# Altium schematic sheet Master_V4.1.SchDoc
size A3; Organization: Altium Limited; Address1: L3, 12a Rodborough Rd; Address2: Frenchs Forest; Address3: NSW; Address4: Australia 2086
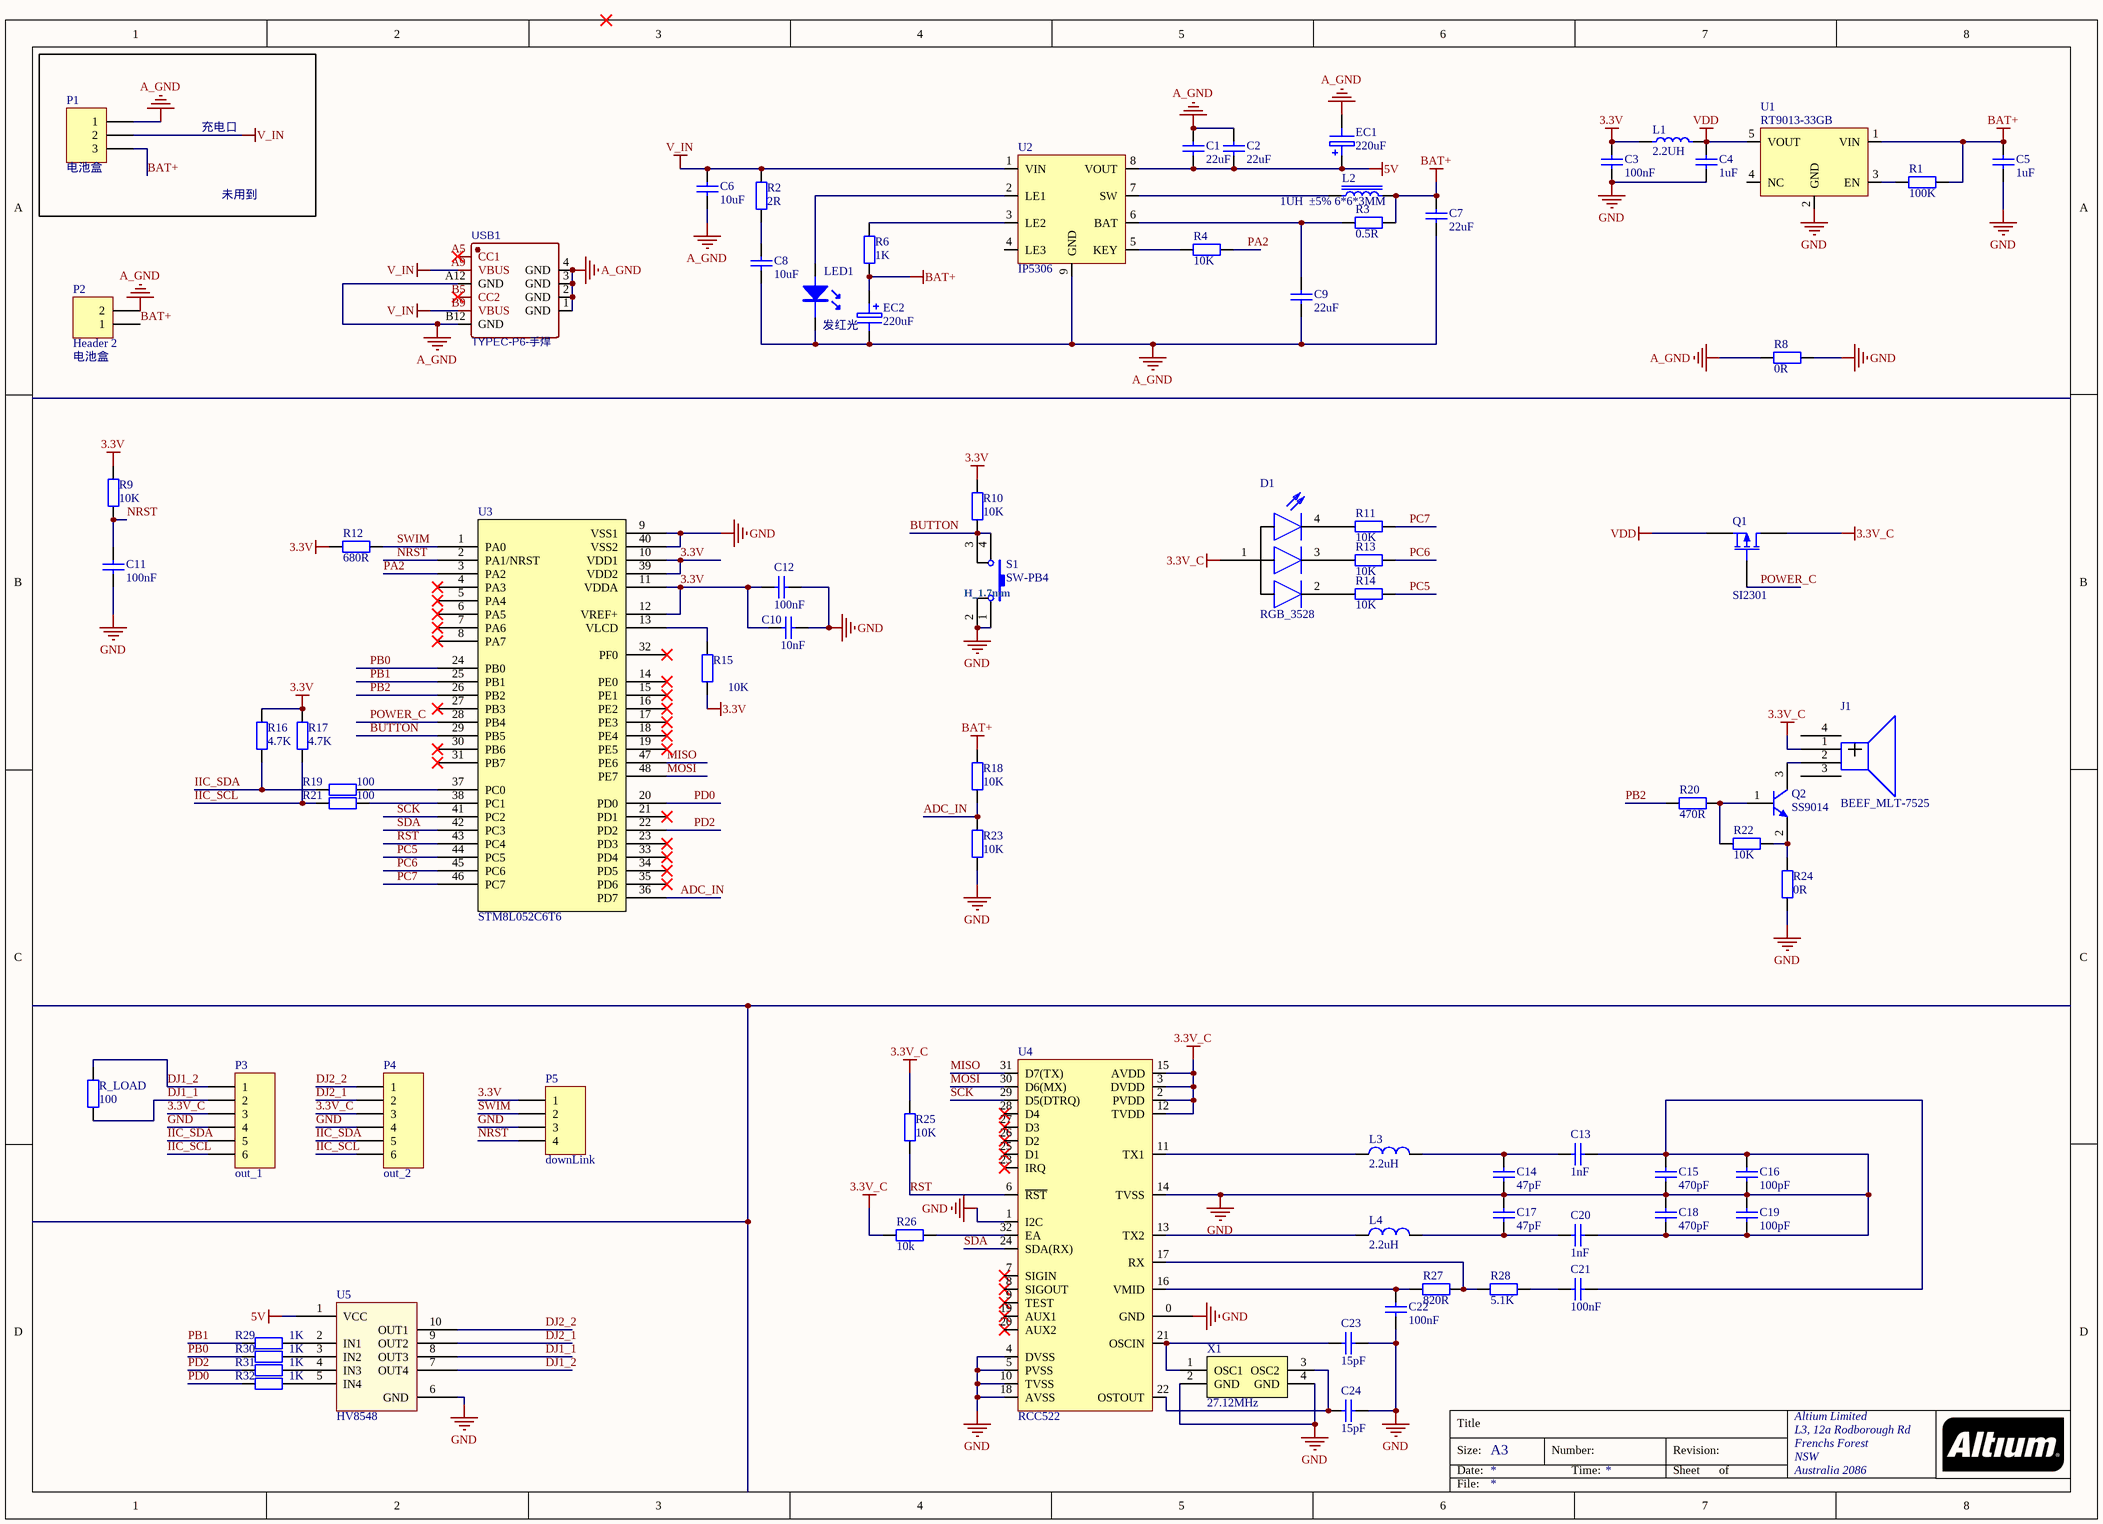
[diagram p0: Master_V4.1.SchDoc]

## Parts
C1  22uF  [C-0603]
C2  22uF  [C-0603]
C3  100nF  [C-0603]
C4  1uF  [C-0603]
C5  1uF  [C-0603]
C6  10uF  [C-0603]
C7  22uF  [C-0603]
C8  10uF  [C-0603]
C9  22uF  [C-0603]
C10  10nF  [C-0603]
C11  100nF  [C-0603]
C12  100nF  [C-0603]
C13  1nF  [C-0603]
C14  47pF  [C-0603]
C15  470pF  [C-0603]
C16  100pF  [C-0603]
C17  47pF  [C-0603]
C18  470pF  [C-0603]
C19  100pF  [C-0603]
C20  1nF  [C-0603]
C21  100nF  [C-0603]
C22  100nF  [C-0603]
C23  15pF  [C-0603]
C24  15pF  [C-0603]
D1  RGB_3528  [SMD3528]
EC1  220uF  [CAP-3528]
EC2  220uF  [CAP-3528]
J1  BEEF_MLT-7525  [MLT-7525]
L1  2.2UH  [0805]
L2  1UH  ±5% 6*6*3MM  [L]
L3  2.2uH  [0805]
L4  2.2uH  [0805]
LED1  发红光  [LED0603_RED]
P1  电池盒  [POWER_3_改]
P2  Header 2  [HDR1X2]
P3  out_1  [乐高水晶头]
P4  out_2  [乐高水晶头]
P5  downLink  [DOWNLOAD_dan]
Q1  SI2301  [SOT-23(SOT-23-3)]
Q2  SS9014  [SOT23-3]
R1  100K  [0603-1]
R2  2R  [0603-1]
R3  0.5R  [0603-1]
R4  10K  [0603-1]
R6  1K  [0603-1]
R8  0R  [0603-1]
R9  10K  [0603-1]
R10  10K  [0603-1]
R11  10K  [0603-1]
R12  680R  [0603-1]
R13  10K  [0603-1]
R14  10K  [0603-1]
R15  10K  [0603-1]
R16  4.7K  [0603-1]
R17  4.7K  [0603-1]
R18  10K  [0603-1]
R19  value 100  [0603-1]  (hidden comment: Res1)
R20  470R  [0603-1]
R21  value 100  [0603-1]  (hidden comment: Res1)
R22  10K  [0603-1]
R23  10K  [0603-1]
R24  0R  [0603-1]
R25  10K  [0603-1]
R26  10k  [0603-1]
R27  820R  [0603-1]
R28  5.1K  [0603-1]
R29  1K  [0603-1]
R30  1K  [0603-1]
R31  1K  [0603-1]
R32  1K  [0603-1]
R_LOAD  value 100  [0603-1]  (hidden comment: Res1)
S1  SW-PB4  [SMD_5*5mm]
U1  RT9013-33GB  [SOT-23-5]
U2  IP5306  [SOP-8]
U3  STM8L052C6T6  [LQFP-48]
U4  RCC522  [QFN-32_5*5]
U5  HV8548  [SOP10]
USB1  TYPEC-P6-手焊  [TYPE_C_6P]
X1  27.12MHz  [SMD_3225]

## Nets
3.3V: C3.1 C10.2 C12.2 L1.1 P5.1 R9.2 R10.2 R12.1 R15.1 R16.2 R17.2 U3.10(VDD1) U3.11(VDDA) U3.12(VREF+) U3.39(VDD2)
3.3V_C: D1.1 J1.1 P3.3 P4.3 Q1.3(D) R25.2 R26.1 U4.2(PVDD) U4.3(DVDD) U4.12(TVDD) U4.15(AVDD)
5V: C1.2 C2.2 EC1.1 U2.8(VOUT) U5.1(VCC)
A_GND: C1.1 C2.1 C6.2 C7.2 C8.1 C9.2 EC1.2 EC2.2 LED1.2 P1.1 P2.2 R8.1 U2.9(GND) USB1.1(GND) USB1.2(GND) USB1.3(GND) USB1.4(GND) USB1.A12(GND) USB1.B12(GND)
BAT+: C5.2 C7.1 EC2.1 L2.2 P1.3 P2.1 R1.2 R3.2 R6.1 R18.1 U1.1(VIN)
GND: C3.2 C4.1 C5.1 C10.1 C11.2 C12.1 C13.2 C14.1 C15.1 C15.2 C16.1 C16.2 C17.2 C18.1 C18.2 C19.1 C19.2 C20.2 C21.1 C22.1 C23.2 C24.2 P3.4 P4.4 P5.3 R8.2 R23.2 R24.1 S1.1 S1.2 U1.2(GND) U3.9(VSS1) U3.40(VSS2) U4.0(GND) U4.1(I2C) U4.4(DVSS) U4.5(PVSS) U4.10(TVSS) U4.14(TVSS) U4.18(AVSS) U5.6(GND) X1.2(GND) X1.4(GND)
V_IN: C6.1 P1.2 R2.2 U2.1(VIN) USB1.A9(VBUS) USB1.B9(VBUS)
VDD: C4.2 L1.2 Q1.2(S) U1.5(VOUT)
ADC_IN: R18.2 R23.1 U3.36(PD7)
BUTTON: R10.1 S1.3 S1.4 U3.29(PB5)
DJ1_1: P3.2 R_LOAD.2 U5.8(OUT3)
DJ1_2: P3.1 R_LOAD.1 U5.7(OUT4)
DJ2_1: P4.2 U5.9(OUT2)
DJ2_2: P4.1 U5.10(OUT1)
IIC_SCL: P3.6 P4.6 R17.1 R21.2
IIC_SDA: P3.5 P4.5 R16.1 R19.2
MISO: U3.47(PE6) U4.31(D7(TX))
MOSI: U3.48(PE7) U4.30(D6(MX))
NRST: C11.1 P5.4 R9.1 U3.2(PA1/NRST)
PA2: R4.2 U3.3(PA2)
PB0: R30.1 U3.24(PB0)
PB1: R29.1 U3.25(PB1)
PB2: R20.1 U3.26(PB2)
PC5: R14.2 U3.44(PC5)
PC6: R13.2 U3.45(PC6)
PC7: R11.2 U3.46(PC7)
PD0: R32.1 U3.20(PD0)
PD2: R31.1 U3.22(PD2)
POWER_C: Q1.1(G) U3.28(PB4)
RST: R25.1 U3.43(PC4) U4.6(~{RST})
SCK: U3.41(PC2) U4.29(D5(DTRQ))
SDA: U3.42(PC3) U4.24(SDA(RX))
SWIM: P5.2 R12.2 U3.1(PA0)
NetC8_2: C8.2 R2.1
NetC9_1: C9.1 R3.1 U2.6(BAT)
NetC13_1: C13.1 C14.2 L3.2
NetC17_1: C17.1 C20.1 L4.2
NetC21_2: C21.2 R28.2
NetC22_2: C22.2 R27.1 U4.16(VMID)
NetC23_1: C23.1 U4.21(OSCIN) X1.1(OSC1)
NetC24_1: C24.1 U4.22(OSTOUT) X1.3(OSC2)
NetD1_2: D1.2 R14.1
NetD1_3: D1.3 R13.1
NetD1_4: D1.4 R11.1
NetJ1_2: J1.2 Q2.3(C)
NetL2_1: L2.1 U2.7(SW)
NetL3_1: L3.1 U4.11(TX1)
NetL4_1: L4.1 U4.13(TX2)
NetLED1_1: LED1.1 U2.2(LE1)
NetQ2_1: Q2.1(B) R20.2 R22.1
NetQ2_2: Q2.2(E) R22.2 R24.2
NetR1_1: R1.1 U1.3(EN)
NetR4_1: R4.1 U2.5(KEY)
NetR6_2: R6.2 U2.3(LE2)
NetR15_2: R15.2 U3.13(VLCD)
NetR19_1: R19.1 U3.37(PC0)
NetR21_1: R21.1 U3.38(PC1)
NetR26_2: R26.2 U4.32(EA)
NetR27_2: R27.2 R28.1 U4.17(RX)
NetR29_2: R29.2 U5.2(IN1)
NetR30_2: R30.2 U5.3(IN2)
NetR31_2: R31.2 U5.4(IN3)
NetR32_2: R32.2 U5.5(IN4)

Not connected (* = marked no-connect by the designer): J1 3 4; U1 4(NC); U2 4(LE3); U3 4(PA3)* 5(PA4)* 6(PA5)* 7(PA6)* 8(PA7)* 14(PE0)* 15(PE1)* 16(PE2)* 17(PE3)* 18(PE4)* 19(PE5)* 21(PD1)* 23(PD3)* 27(PB3)* 30(PB6)* 31(PB7)* 32(PF0)* 33(PD4)* 34(PD5)* 35(PD6)*; U4 7(SIGIN)* 8(SIGOUT)* 9(TEST)* 19(AUX1)* 20(AUX2)* 23(IRQ)* 25(D1)* 26(D2)* 27(D3)* 28(D4)*; USB1 A5(CC1)* B5(CC2)*

## Notes on the sheet
- 充电口
- 未用到
- (near P2) 电池盒
- (near S1) H_1.7mm
- Title
- Size:
- Date:
- A3
- Number:
- Time:
- Revision:
- Sheet
- of
- File:

## Library data of the parts
C1 C2 C7 C9 = 22uF: 贴片瓷片电容; Published: 8-Jun-2000; LatestRevisionDate: 17-Jul-2002; LatestRevisionNote: Re-released for DXP Platform.; PackageReference: RAD-0.3; Publisher: Altium Limited; PackageDescription: Radial Cap, Thru-Hole; 2 Leads; 0.3 in Pin Spacing
C3 C11 C12 C21 C22 = 100nF: 贴片瓷片电容; Published: 8-Jun-2000; LatestRevisionDate: 17-Jul-2002; LatestRevisionNote: Re-released for DXP Platform.; PackageReference: RAD-0.3; Publisher: Altium Limited; PackageDescription: Radial Cap, Thru-Hole; 2 Leads; 0.3 in Pin Spacing
C4 C5 = 1uF: 贴片瓷片电容; Published: 8-Jun-2000; LatestRevisionDate: 17-Jul-2002; LatestRevisionNote: Re-released for DXP Platform.; PackageReference: RAD-0.3; Publisher: Altium Limited; PackageDescription: Radial Cap, Thru-Hole; 2 Leads; 0.3 in Pin Spacing
C6 C8 = 10uF: 贴片瓷片电容; Published: 8-Jun-2000; LatestRevisionDate: 17-Jul-2002; LatestRevisionNote: Re-released for DXP Platform.; PackageReference: RAD-0.3; Publisher: Altium Limited; PackageDescription: Radial Cap, Thru-Hole; 2 Leads; 0.3 in Pin Spacing
C10 = 10nF: 贴片瓷片电容; Published: 8-Jun-2000; LatestRevisionDate: 17-Jul-2002; LatestRevisionNote: Re-released for DXP Platform.; PackageReference: RAD-0.3; Publisher: Altium Limited; PackageDescription: Radial Cap, Thru-Hole; 2 Leads; 0.3 in Pin Spacing
C13 C20 = 1nF: 贴片瓷片电容; Published: 8-Jun-2000; LatestRevisionDate: 17-Jul-2002; LatestRevisionNote: Re-released for DXP Platform.; PackageReference: RAD-0.3; Publisher: Altium Limited; PackageDescription: Radial Cap, Thru-Hole; 2 Leads; 0.3 in Pin Spacing
C14 C17 = 47pF: 贴片瓷片电容; Published: 8-Jun-2000; LatestRevisionDate: 17-Jul-2002; LatestRevisionNote: Re-released for DXP Platform.; PackageReference: RAD-0.3; Publisher: Altium Limited; PackageDescription: Radial Cap, Thru-Hole; 2 Leads; 0.3 in Pin Spacing
C15 C18 = 470pF: 贴片瓷片电容; Published: 8-Jun-2000; LatestRevisionDate: 17-Jul-2002; LatestRevisionNote: Re-released for DXP Platform.; PackageReference: RAD-0.3; Publisher: Altium Limited; PackageDescription: Radial Cap, Thru-Hole; 2 Leads; 0.3 in Pin Spacing
C16 C19 = 100pF: 贴片瓷片电容; Published: 8-Jun-2000; LatestRevisionDate: 17-Jul-2002; LatestRevisionNote: Re-released for DXP Platform.; PackageReference: RAD-0.3; Publisher: Altium Limited; PackageDescription: Radial Cap, Thru-Hole; 2 Leads; 0.3 in Pin Spacing
C23 C24 = 15pF: 贴片瓷片电容; Published: 8-Jun-2000; LatestRevisionDate: 17-Jul-2002; LatestRevisionNote: Re-released for DXP Platform.; PackageReference: RAD-0.3; Publisher: Altium Limited; PackageDescription: Radial Cap, Thru-Hole; 2 Leads; 0.3 in Pin Spacing
EC1 EC2 = 220uF: 3528钽电容
L1 = INCT
L2 = INCT_1
L3 L4 = INDUCTANCE: Value: 2.2uH
LED1 = LED
P1 = Header 3: Header, 3-Pin; LatestRevisionDate: 17-Jul-2002; LatestRevisionNote: Re-released for DXP Platform.; Publisher: Altium Limited
P2 = Header 2: Header, 2-Pin; LatestRevisionDate: 17-Jul-2002; LatestRevisionNote: Re-released for DXP Platform.; Publisher: Altium Limited
P3 P4 = Header 6: Header, 6-Pin; LatestRevisionDate: 17-Jul-2002; LatestRevisionNote: Re-released for DXP Platform.; Publisher: Altium Limited
P5 = Header 4: Header, 4-Pin; LatestRevisionDate: 17-Jul-2002; LatestRevisionNote: Re-released for DXP Platform.; Publisher: Altium Limited
Q1 = MOSFET-P: P-Channel MOSFET; Published: 8-Jun-2000; LatestRevisionDate: 17-Jul-2002; LatestRevisionNote: Re-released for DXP Platform.; PackageVersion: 1995/1996; PackageReference: E3; Publisher: Altium Limited; PackageDescription: TO, Flat Index; 3 In-Line, Axial Leads; Body Dia. 4.6mm; Lead Dia. 0.5 mm (max)
Q2 = SS9014: NPN贴片三极管; Published: 8-Jun-2000; LatestRevisionDate: 15-Jan-2003; LatestRevisionNote: PCB Footprint 'BCY-W3/D4.7' replaced; DatasheetDocument: 1997; PackageDocument: Sep-1998; PackageReference: TO-92A; Publisher: Altium Limited; Code_JEDEC: TO-92A; ComponentLink1Description: Manufacturer Link; ComponentLink1URL: http://www.fairchildsemi.com/; ComponentLink2Description: Datasheet; ComponentLink2URL: http://www.fairchildsemi.com/ds/2N%2F2N3904.pdf
R1 = 100K: 贴片电阻; Published: 8-Jun-2000; LatestRevisionDate: 17-Jul-2002; LatestRevisionNote: Re-released for DXP Platform.; PackageReference: AXIAL-0.4; Publisher: Altium Limited
R2 = 2R: 贴片电阻; Published: 8-Jun-2000; LatestRevisionDate: 17-Jul-2002; LatestRevisionNote: Re-released for DXP Platform.; PackageReference: AXIAL-0.4; Publisher: Altium Limited
R3 = 0.5R: 贴片电阻; Published: 8-Jun-2000; LatestRevisionDate: 17-Jul-2002; LatestRevisionNote: Re-released for DXP Platform.; PackageReference: AXIAL-0.4; Publisher: Altium Limited
R4 R9-R11 R13-R15 R18 R22 R23 R25 = 10K: 贴片电阻; Published: 8-Jun-2000; LatestRevisionDate: 17-Jul-2002; LatestRevisionNote: Re-released for DXP Platform.; PackageReference: AXIAL-0.4; Publisher: Altium Limited
R6 R26 R29-R32 = 1K: 贴片电阻; Published: 8-Jun-2000; LatestRevisionDate: 17-Jul-2002; LatestRevisionNote: Re-released for DXP Platform.; PackageReference: AXIAL-0.4; Publisher: Altium Limited
R8 R24 = 0R: 贴片电阻; Published: 8-Jun-2000; LatestRevisionDate: 17-Jul-2002; LatestRevisionNote: Re-released for DXP Platform.; PackageReference: AXIAL-0.4; Publisher: Altium Limited
R12 = 680R: 贴片电阻; Published: 8-Jun-2000; LatestRevisionDate: 17-Jul-2002; LatestRevisionNote: Re-released for DXP Platform.; PackageReference: AXIAL-0.4; Publisher: Altium Limited
R16 R17 = 4.7K: 贴片电阻; Published: 8-Jun-2000; LatestRevisionDate: 17-Jul-2002; LatestRevisionNote: Re-released for DXP Platform.; PackageReference: AXIAL-0.4; Publisher: Altium Limited
R19 R21 R_LOAD = Res1: 贴片电阻; Published: 8-Jun-2000; LatestRevisionDate: 17-Jul-2002; LatestRevisionNote: Re-released for DXP Platform.; PackageReference: AXIAL-0.4; Publisher: Altium Limited
R20 = 470R: 贴片电阻; Published: 8-Jun-2000; LatestRevisionDate: 17-Jul-2002; LatestRevisionNote: Re-released for DXP Platform.; PackageReference: AXIAL-0.4; Publisher: Altium Limited
R27 = 820R: 贴片电阻; Published: 8-Jun-2000; LatestRevisionDate: 17-Jul-2002; LatestRevisionNote: Re-released for DXP Platform.; PackageReference: AXIAL-0.4; Publisher: Altium Limited
R28 = 5.1K: 贴片电阻; Published: 8-Jun-2000; LatestRevisionDate: 17-Jul-2002; LatestRevisionNote: Re-released for DXP Platform.; PackageReference: AXIAL-0.4; Publisher: Altium Limited
S1 = SW-PB4: 微动开关; Published: 24-Mar-1999; LatestRevisionDate: 17-Jul-2002; LatestRevisionNote: Re-released for DXP Platform.; PackageReference: SPST-2; Publisher: Altium Limited
U5 = LV8548
USB1 = TYPEC-P6-手焊: BOM_Manufacturer: XUNPU; BOM_Manufacturer Part: TYPEC-250D-BCP6; Contributor: LCSC; BOM_Supplier: LCSC; BOM_Supplier Part: C720626; spicePre: U; spiceSymbolName: TYPEC-P6-手焊